# Altium schematic sheet Power.SchDoc: Power
size A4; CompanyName: 42; Engineer: SCHIAD VCHESNEA
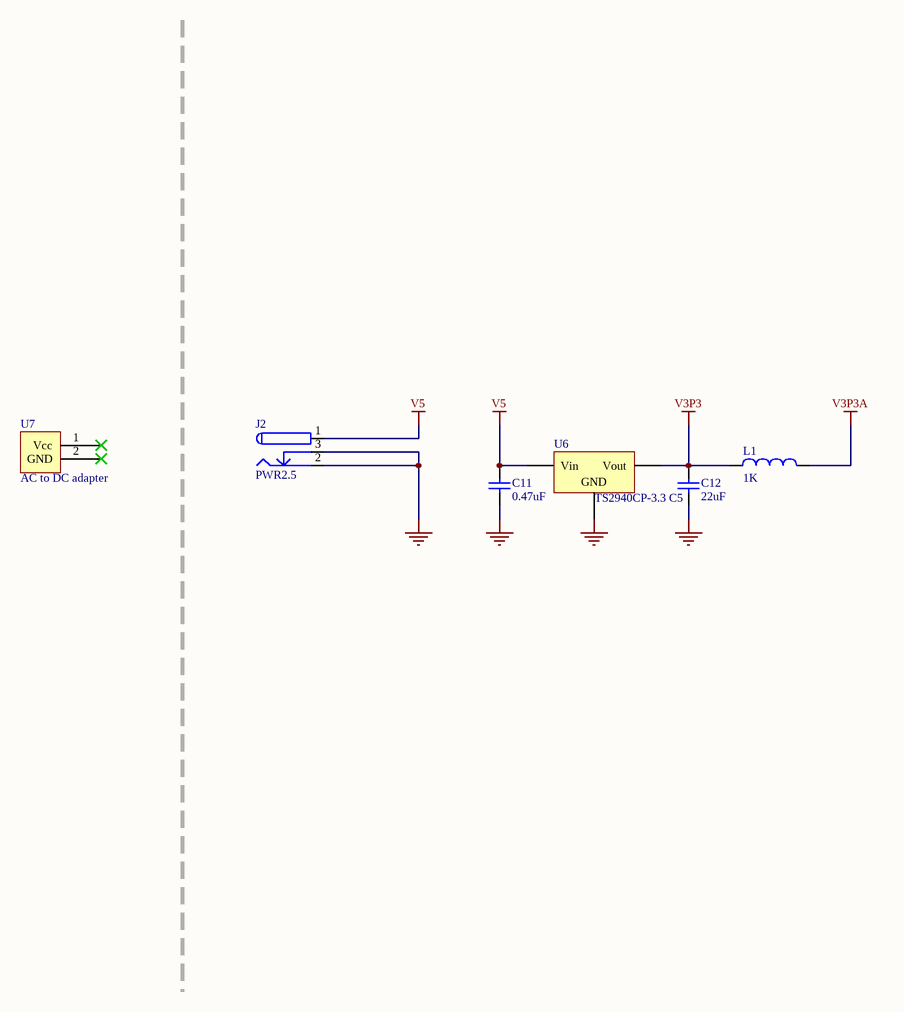
[diagram p0: Power.SchDoc]

## Parts
C11  0.47uF  [CAP0603]
C12  22uF  [CAP0603]
J2  PWR2.5  [MJ-179PH]
L1  1K  [IND0603]
U6  TS2940CP-3.3 C5  [TS2940CP-3.3 C5]
U7  AC to DC adapter  (mechanical)

## Nets
GND: C11.1 C12.1 J2.2 J2.3 U6.2(GND)
V3P3: C12.2 L1.1 U6.3(Vout)
V3P3A: L1.2
V5: C11.2 J2.1 U6.1(Vin)

Not connected (* = marked no-connect by the designer): U7 1(Vcc)* 2(GND)*

## Notes on the sheet
- Title
- Size:
- Date:
- A4
- Number:
- Time:
- Revision:
- Sheet
- of
- File:

## Library data of the parts
C11 C12 = Cap: Capacitor; Published: 8-Jun-2000; LatestRevisionDate: 17-Jul-2002; LatestRevisionNote: Re-released for DXP Platform.; PackageReference: RAD-0.3; Publisher: Altium Limited; PackageDescription: Radial Cap, Thru-Hole; 2 Leads; 0.3 in Pin Spacing
  C11: Value: 0.47uF
  C12: Value: 22uF
J2 = PWR2.5: Low Voltage Power Supply Connector; Fabricant: MULTICOMP; Fournisseur: Farnell; RefFournisseur: 1737246; RefFabricant: MJ-179PH
L1 = Inductor: Code_IEC: 1005; RefFournisseur: 1115051; RefFabricant: BLM18TG102TN1D; Fabricant: Murata; Fournisseur: Farnell; Published: 8-Jun-2000; LatestRevisionDate: 29-May-2009; LatestRevisionNote: IPC-7351 Footprint Added.; PackageReference: 0402-A; Publisher: Altium Limited; PackageDescription: Chip Inductor; Code_JEITA: 0402; Value: 1K
U6 = Volt Reg: Voltage Regulator; Fabricant: TAIWAN SEMICONDUCTOR; Fournisseur: Farnell; RefFournisseur: 7261390; RefFabricant: TS2940CP-3.3 C5
U7 = 25HK-AB-050A400-CP: Power adapter; RefFournisseur: 2334613; Fabricant: IDEAL POWER; Fournisseur: Farnell; RefFabricant: 25HK-AB-050A400-CP